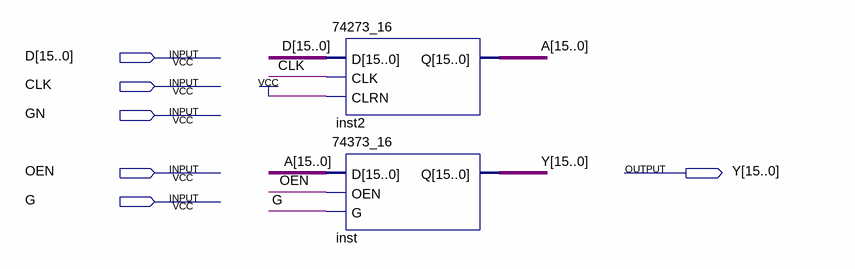
[diagram p0: schematic sheet]
// Quartus schematic Bus_Latch.bdf as structural Verilog: 2 symbols, 6 pins
module Bus_Latch (
  input  [15:0] D,
  input  CLK,
  input  GN,
  input  OEN,
  input  G,
  output [15:0] Y
);

  wire [15:0] A;

  \74273_16  inst2 (.D(D), .CLK(CLK), .CLRN(1'b1), .Q(A));
  \74373_16  inst (.D(A), .OEN(OEN), .G(G), .Q(Y));
endmodule
